# Altium project Power_Stage_SOIC.PrjPCB
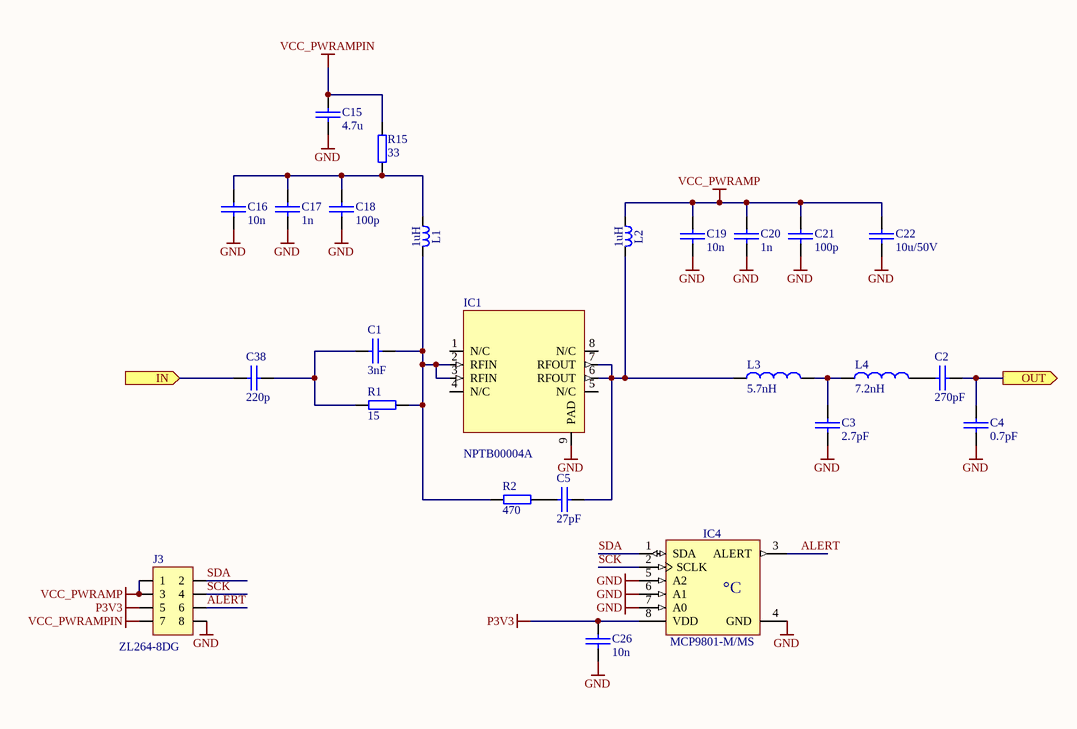
[diagram p0: Power_Stage_NPTB00004A.SchDoc]
1 sheet, 25 parts. Net scope: flat (ports and power ports of the same name join across sheets).
Board file: PA_Channel_RF2_NPTB00004A.PcbDoc

## Sheet Power_Stage_NPTB00004A.SchDoc
size A4

### Parts
C1  3nF  [0603C]
C2  270pF  [0603C]
C3  2.7pF  [0603C]
C4  0.7pF  [0603C]
C5  27pF  [0603C]
C15  4.7u  [0603C]
C16  10n  [0603C]
C17  1n  [0603C]
C18  100p  [0603C]
C19  10n  [0603C]
C20  1n  [0603C]
C21  100p  [0603C]
C22  10u/50V  [0805C]
C26  10n  [0603C]
C38  220p  [0603C]
IC1  NPTB00004A  [SOIC127P610X150_HS-8N]
IC4  MCP9801-M/MS  [SOP65P490X110-8N]
J3  ZL264-8DG  [ZL264-8DG]
L1  1uH  [INDP2520X18L]
L2  1uH  [INDP2520X18L]
L3  5.7nH  [0603L]
L4  7.2nH  [0603L]
R1  15  [0603R]
R2  470  [0603R]
R15  33  [0603R]

### Ports
IN (in), OUT (out)

### Nets
GND: C3.2 C4.2 C15.2 C16.2 C17.2 C18.2 C19.2 C20.2 C21.2 C22.2 C26.1 IC1.9(PAD) IC4.4(GND) IC4.5(A2) IC4.6(A1) IC4.7(A0) J3.8
P3V3: C26.2 IC4.8(VDD) J3.5
VCC_PWRAMP: C19.1 C20.1 C21.1 C22.1 J3.1 J3.3 L2.1
VCC_PWRAMPIN: C15.1 J3.7 R15.2
ALERT: IC4.3(ALERT) J3.6
SCK: IC4.2(SCLK) J3.4
SDA: IC4.1(SDA) J3.2
NetC1_1: C1.1 C38.2 R1.1
NetC1_2: C1.2 IC1.2(RFIN) IC1.3(RFIN) L1.2 R1.2 R2.1
NetC2_1: C2.1 L4.2
NetC2_2: C2.2 C4.1 ; port OUT
NetC3_1: C3.1 L3.2 L4.1
NetC5_1: C5.1 R2.2
NetC5_2: C5.2 IC1.6(RFOUT) IC1.7(RFOUT) L2.2 L3.1
NetC16_1: C16.1 C17.1 C18.1 L1.1 R15.1
NetC38_1: C38.1 ; port IN

Not connected (* = marked no-connect by the designer): IC1 1(N/C) 4(N/C) 5(N/C) 8(N/C)

### Notes on the sheet
- (in symbol MCP9801-M/MS) °C

### Library data of the parts
C1-C5 C26 = CAP_SMD_0603: Capacitor SMD
  C3 C4 C26: Supplier 1: Digi-Key; Supplier Part Number 1: 490-1524-2-ND
C15 = CAP_SMD_0603: Capacitor SMD; Part: GRM21BR71C475KE51L; Supplier 1: Digi-Key; Supplier Part Number 1: 490-1524-2-ND
C16 C19 = CAP_SMD_0603: Capacitor SMD; Part: GRM1885C1H103JA01D; Supplier 1: Digi-Key; Supplier Part Number 1: 490-1524-2-ND
C17 C20 = CAP_SMD_0603: Capacitor SMD; Part: GRM1885C1H102JA01D; Supplier 1: Digi-Key; Supplier Part Number 1: 490-1524-2-ND
C18 C21 = CAP_SMD_0603: Capacitor SMD; Part: C1608NP01H101J080AA; Supplier 1: Digi-Key; Supplier Part Number 1: 490-1524-2-ND
C22 = CAP_SMD_0805: Capacitor SMD; Part: GRM32ER71H106KA12L; Supplier 1: Farnell; Supplier Part Number 1: 1833812
C38 = CAP_SMD_0603: Capacitor SMD; Part: GRM1885C1H221GA01D; Supplier 1: Digi-Key; Supplier Part Number 1: 490-1524-2-ND
IC1 = RF_NPTB00004A: GaN Wideband Transistor 28 V, 5 W DC  - 6 GHz
IC4 = MCP9801-M/MS: 2-Wire High-Accuracy Temperature Sensor; Manufacturer: MICROCHIP TECHNOLOGIY; PressFit: No; Bonding: No; Part Number: MCP9801-M/MS; Component Kind: Standard; Component Type: Standard; Device: MCP9801-M/MS; PackageDescription: SOP, 0.65mm pitch; 8 pin, 3.00mm W X 3.00mm L X 1.10mm H body, IPC Medium Density; Part Description: 2-Wire High-Accuracy Temperature Sensor; Manufacturer Part Number: MCP9801-M/MS; Pin Count: 8; Case: MSOP8; Mounted: Yes; Socket: No; SMD: Yes; Sense: No; ComponentHeight: 1.1mm; HelpURL: \\cern.ch\dfs\Applications\Altium\Datasheets\MCP9801-M-MS.pdf; Author: CERN DEM JLC; CreateDate: 18.11.2009; LatestRevisionDate: 18.11.2009
J3 = CON_2X4 2.54 SMT FEM: 2.54mm pitch connector
L1 = L_1008_100u: Part: LQW2UAS1R0J00L; Author: GK
L2 = L_1008_100u: 100uH, 60mA, 21R; Part: 1008LS-102XJLB; Author: GK
L3 L4 = L_0603: SMT inductor
R1 R2 = RES_0603: SMD Resistor
R15 = RES_0603: SMD Resistor; Part: CR0603-FX-33R0ELF; Supplier 1: Newark; Supplier Part Number 1: 39K0073